# Altium project V67_DASH_VCU.PrjPcb
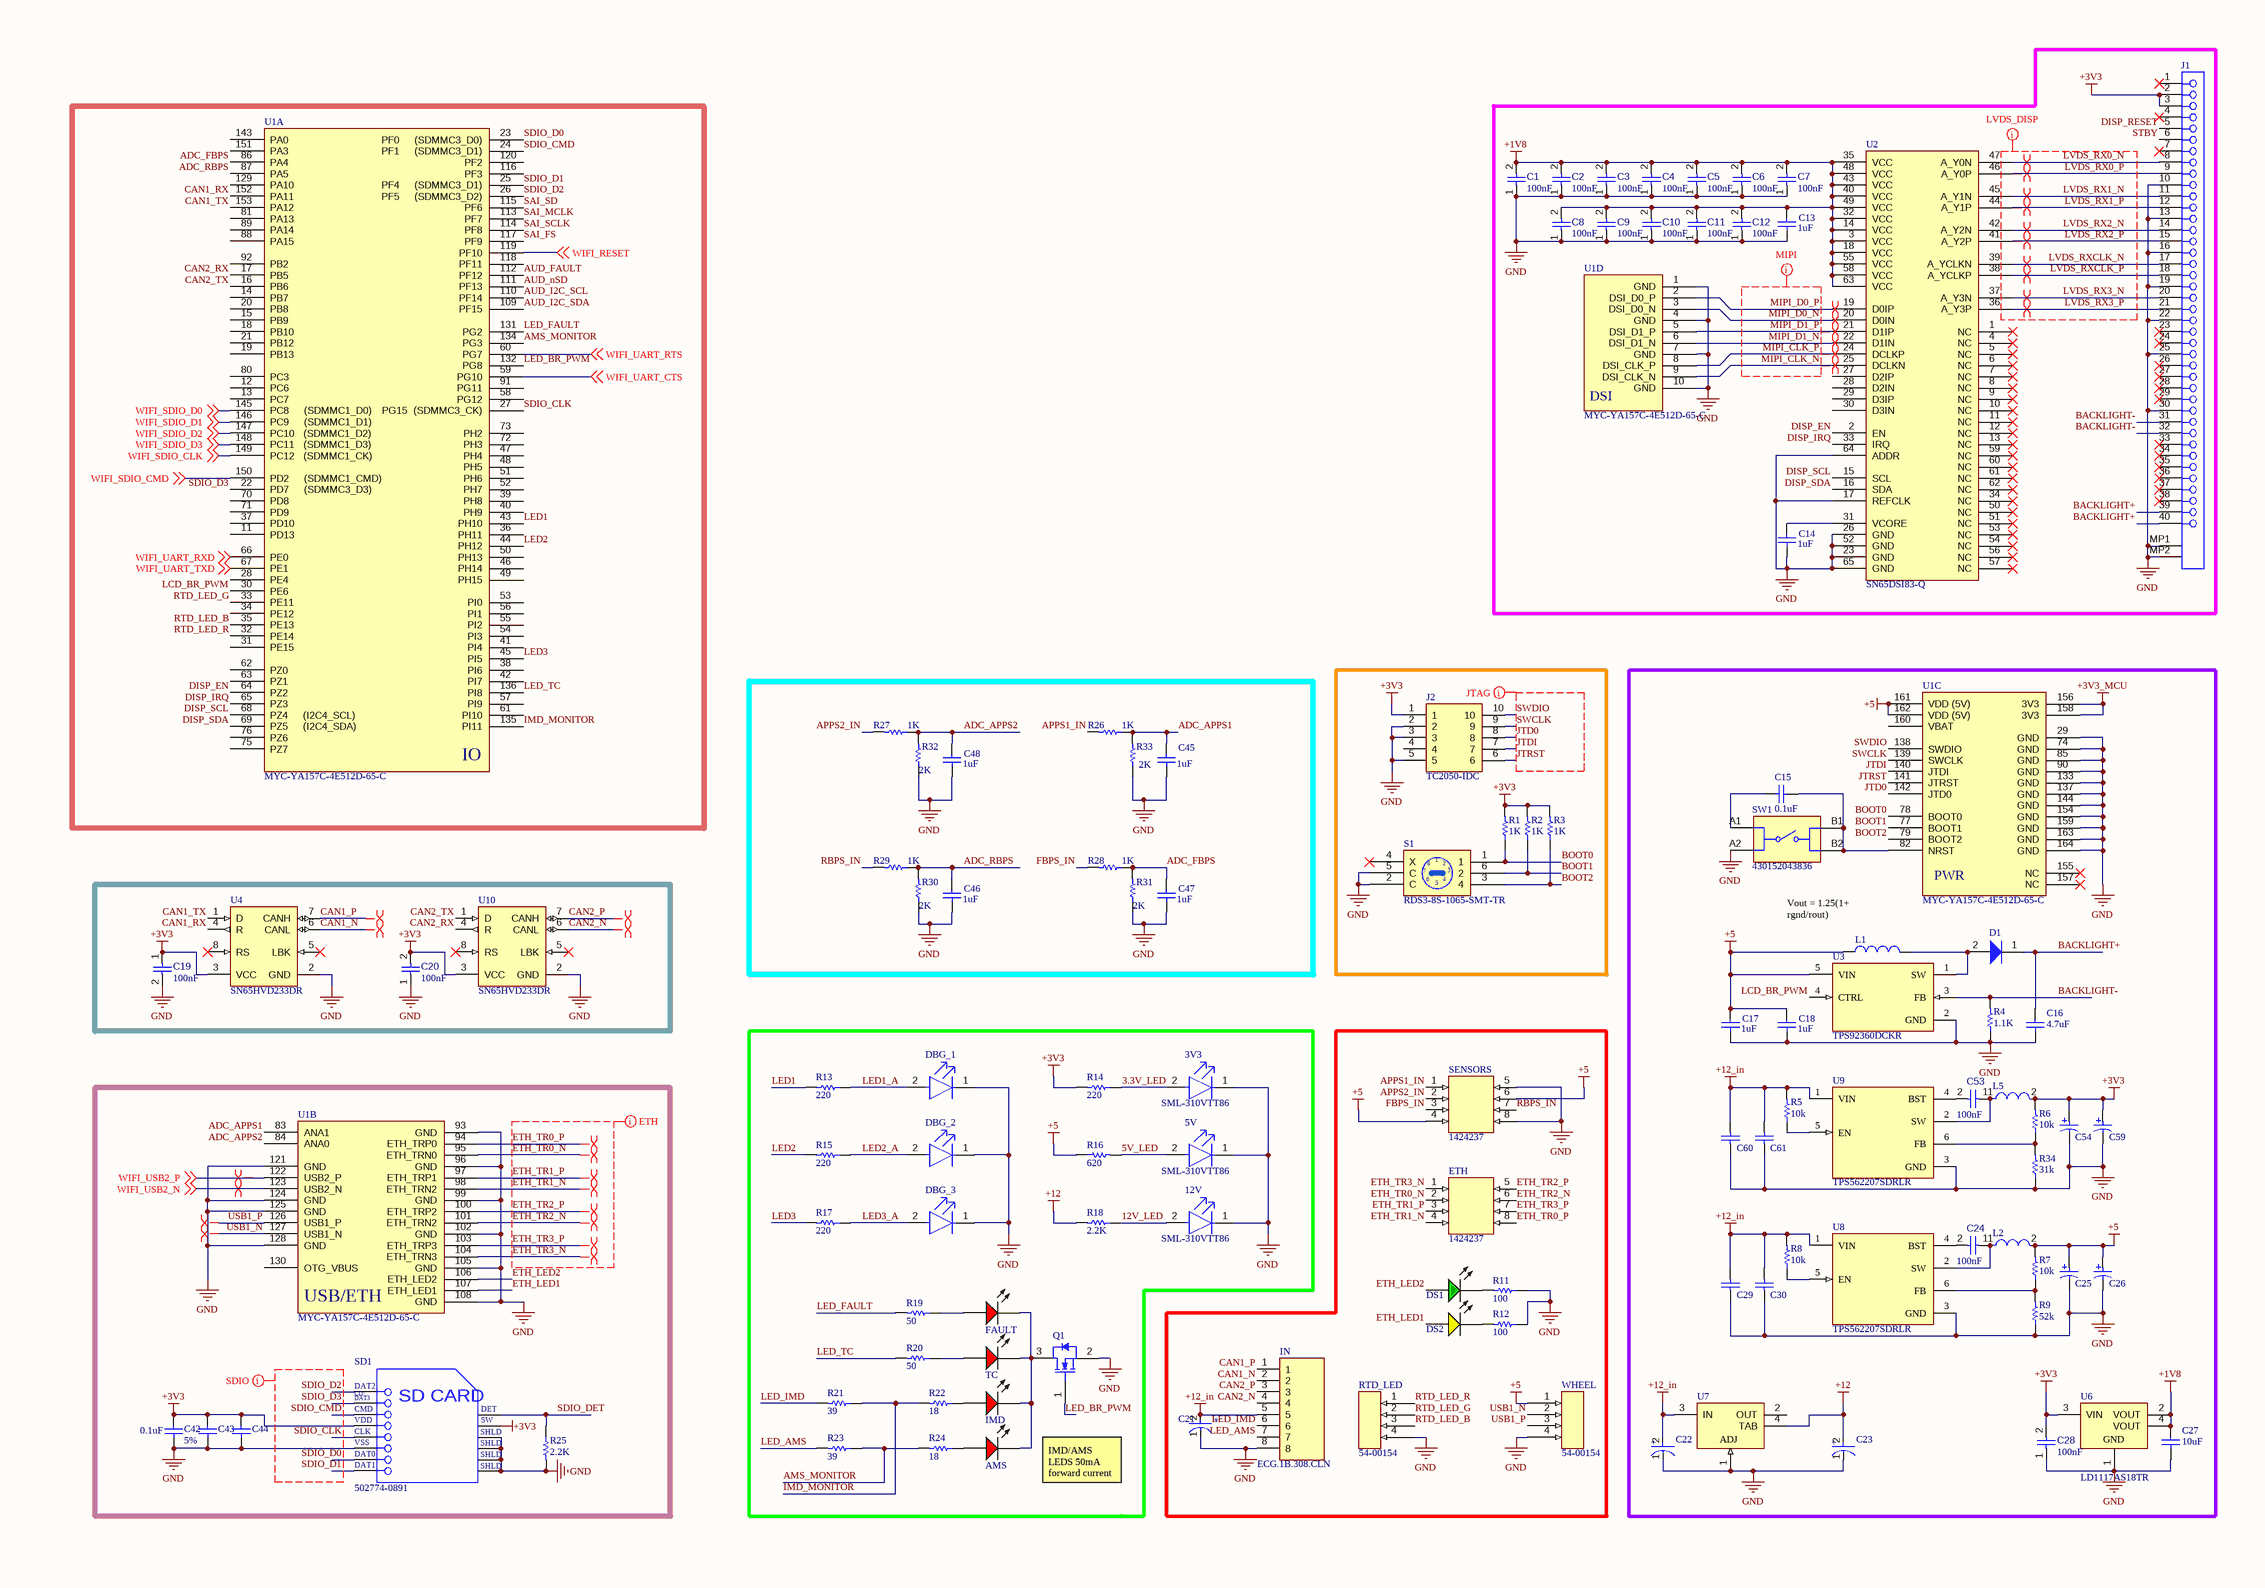
[diagram p0: Main.SchDoc]
CAGE_CODE: ?????; CONTRACT_NUMBER: <CONTRACT NO>; DOC_NO_ASSY_DWG: <ASSY DWG NO>; DOC_NO_BOM: <BOM DOC NO>; DOC_NO_FAB_DWG: <FAB DWG NO>; DOC_NO_SCH_DWG: <SCH DWG NO>; PCB_2_DEC_TOL: +/-.01; PCB_3_DEC_TOL: +/-.010; PCB_ANG_TOL: +/-1/2; PCB_ASSEMBLY_NO: <PCB ASSY NO>; PCB_CHECKER: - -----; PCB_CHECKER_APP_DATE: --/--/----; PCB_DESIGNER: - -----; PCB_DESIGNER_APP_DATE: --/--/----; PCB_DWG_NO: <PCB DWG NO>; PCB_ENGINEER: - -----; PCB_ENGINEER_APP_DATE: --/--/----; PCB_PART_NUMBER: <PCB PN>; PCB_REV: A; SCH_REV: A
3 sheets, 136 parts. Net scope: global (net labels, ports and power ports of the same name join across sheets).
Sheets:
  Main.SchDoc
  wifi.SchDoc
  audio.SchDoc

## Sheet Main.SchDoc
size 508 x 355 mm; SheetNumber: 1; SheetTotal: 3; ENG_APP_DATE: --/--/--; DSN_APP_DATE: --/--/--; CHK_APP_DATE: --/--/--

### Parts
3V3  SML-310VTT86  [FP-SML-310VTT86-MFG]
5V  SML-310VTT86  [FP-SML-310VTT86-MFG]
12V  SML-310VTT86  [FP-SML-310VTT86-MFG]
AMS  C503B-RAN-CY0B0AA2  [CREE-C503B-RAN]  (value not drawn)
C1  value 100nF  [CAPC0402(1005)60_L]  (hidden comment: Capacitor 100nF +/-20% 25V 0402)
C2  value 100nF  [CAPC0402(1005)60_L]  (hidden comment: Capacitor 100nF +/-20% 25V 0402)
C3  value 100nF  [CAPC0402(1005)60_L]  (hidden comment: Capacitor 100nF +/-20% 25V 0402)
C4  value 100nF  [CAPC0402(1005)60_L]  (hidden comment: Capacitor 100nF +/-20% 25V 0402)
C5  value 100nF  [CAPC0402(1005)60_L]  (hidden comment: Capacitor 100nF +/-20% 25V 0402)
C6  value 100nF  [CAPC0402(1005)60_L]  (hidden comment: Capacitor 100nF +/-20% 25V 0402)
C7  value 100nF  [CAPC0402(1005)60_L]  (hidden comment: Capacitor 100nF +/-20% 25V 0402)
C8  value 100nF  [CAPC0402(1005)60_L]  (hidden comment: Capacitor 100nF +/-20% 25V 0402)
C9  value 100nF  [CAPC0402(1005)60_L]  (hidden comment: Capacitor 100nF +/-20% 25V 0402)
C10  value 100nF  [CAPC0402(1005)60_L]  (hidden comment: Capacitor 100nF +/-20% 25V 0402)
C11  value 100nF  [CAPC0402(1005)60_L]  (hidden comment: Capacitor 100nF +/-20% 25V 0402)
C12  value 100nF  [CAPC0402(1005)60_L]  (hidden comment: Capacitor 100nF +/-20% 25V 0402)
C13  value 1uF  [1608[0603]]  (hidden comment: Cap)
C14  value 1uF  [1608[0603]]  (hidden comment: Cap)
C15  value 0.1uF  [1608[0603]]  (hidden comment: Cap)
C16  value 4.7uF  [1608[0603]]  (hidden comment: Cap)
C17  value 1uF  [1608[0603]]  (hidden comment: Cap)
C18  value 1uF  [1608[0603]]  (hidden comment: Cap)
C19  value 100nF  [CAPC0402(1005)60_L]  (hidden comment: Capacitor 100nF +/-20% 25V 0402)
C20  value 100nF  [CAPC0402(1005)60_L]  (hidden comment: Capacitor 100nF +/-20% 25V 0402)
C21  EEFCX0G181XR  [FP-SP-Cap-X-MFG]  (value not drawn)
C22  T491B106K025AT  [FP-T491B106K025AT-MFG]  (value not drawn)
C23  T491B106K025AT  [FP-T491B106K025AT-MFG]  (value not drawn)
C24  value 100nF  [CAPC0402(1005)60_L]  (hidden comment: Capacitor 100nF +/-20% 25V 0402)
C25  T491B226K010AT  [KEMT-T491-B_L]  (value not drawn)
C26  T491B226K010AT  [KEMT-T491-B_L]  (value not drawn)
C27  value 10uF  [1608[0603]]  (hidden comment: Cap)
C28  value 100nF  [CAPC0402(1005)60_L]  (hidden comment: Capacitor 100nF +/-20% 25V 0402)
C29  TACR106K016XTA  [CAPC2014X150X70NL20]  (value not drawn)
C30  TACR106K016XTA  [CAPC2014X150X70NL20]  (value not drawn)
C42  value 0.1uF  Tolerance: 5%  [1608[0603]]  (hidden comment: Cap)
C43  Cap  [1608[0603]]  (value not drawn)
C44  Cap  [1608[0603]]  (value not drawn)
C45  value 1uF  [1608[0603]]  (hidden comment: Cap)
C46  value 1uF  [1608[0603]]  (hidden comment: Cap)
C47  value 1uF  [1608[0603]]  (hidden comment: Cap)
C48  value 1uF  [1608[0603]]  (hidden comment: Cap)
C53  value 100nF  [CAPC0402(1005)60_L]  (hidden comment: Capacitor 100nF +/-20% 25V 0402)
C54  T491B226K010AT  [KEMT-T491-B_L]  (value not drawn)
C59  T491B226K010AT  [KEMT-T491-B_L]  (value not drawn)
C60  TACR106K016XTA  [CAPC2014X150X70NL20]  (value not drawn)
C61  TACR106K016XTA  [CAPC2014X150X70NL20]  (value not drawn)
D1  NSR0240HT1G  [ONSC-SOD-323-2-477-02_V]  (value not drawn)
DBG_1  SML-310VTT86  [FP-SML-310VTT86-MFG]  (value not drawn)
DBG_2  SML-310VTT86  [FP-SML-310VTT86-MFG]  (value not drawn)
DBG_3  SML-310VTT86  [FP-SML-310VTT86-MFG]  (value not drawn)
DS1  HSMG-C190  [AVAG-HSMX-C190_V]  (value not drawn)
DS2  HSMY-C190  [AVAG-HSMX-C190_V]  (value not drawn)
ETH  1424237  [1424237]
FAULT  C503B-RAN-CY0B0AA2  [CREE-C503B-RAN]  (value not drawn)
IMD  C503B-RAN-CY0B0AA2  [CREE-C503B-RAN]  (value not drawn)
IN  ECG.1B.308.CLN  [LEMO_ECG.1B.308.CLN]
J1  54104-4031  [MOLX-54104-4031]  (value not drawn)
J2  TC2050-IDC  [TC2050-IDC]
L1  LPS4018-472MR  [LPS4018-472MR-Footprint-1]  (value not drawn)
L2  IHLP2525AHER4R7M01  [FP-IHLP-2525AH-FP_2_413x3-MFG]  (value not drawn)
L5  IHLP2525AHER4R7M01  [FP-IHLP-2525AH-FP_2_413x3-MFG]  (value not drawn)
Q1  NTR4170NT1G  [ONSC-SOT-23-3-318-08_V]  (value not drawn)
R1  1K  [RESC1609X50X30NL8T20]
R2  1K  [RESC1609X50X30NL8T20]
R3  1K  [RESC1609X50X30NL8T20]
R4  1.1K  [RESC1609X50X30NL8T20]
R5  10k  [RESC1609X50X30NL8T20]
R6  10k  [RESC1609X50X30NL8T20]
R7  10k  [RESC1609X50X30NL8T20]
R8  10k  [RESC1609X50X30NL8T20]
R9  52k  [RESC1609X50X30NL8T20]
R11  100  [RESC1609X50X30NL8T20]
R12  100  [RESC1609X50X30NL8T20]
R13  220  [RESC1609X50X30NL8T20]
R14  220  [RESC1609X50X30NL8T20]
R15  220  [RESC1609X50X30NL8T20]
R16  620  [RESC1609X50X30NL8T20]
R17  220  [RESC1609X50X30NL8T20]
R18  2.2K  [RESC1609X50X30NL8T20]
R19  50  [RESC1609X50X30NL8T20]
R20  50  [RESC1609X50X30NL8T20]
R21  39  [RESC1609X50X30NL8T20]
R22  18  [RESC1609X50X30NL8T20]
R23  39  [RESC1609X50X30NL8T20]
R24  18  [RESC1609X50X30NL8T20]
R25  2.2K  [RESC1609X50X30NL8T20]
R26  1K  [RESC1609X50X30NL8T20]
R27  1K  [RESC1609X50X30NL8T20]
R28  1K  [RESC1609X50X30NL8T20]
R29  1K  [RESC1609X50X30NL8T20]
R30  2K  [RESC1609X50X30NL8T20]
R31  2K  [RESC1609X50X30NL8T20]
R32  2K  [RESC1609X50X30NL8T20]
R33  2K  [RESC1609X50X30NL8T20]
R34  31k  [RESC1609X50X30NL8T20]
RTD_LED  54-00154  [54-00154-Footprint-1]
S1  RDS3-8S-1065-SMT-TR  [RDS3-8S-1065-SMT-TR-Footprint-1]
SD1  502774-0891  [MOLX-502774-0891_V]
SENSORS  1424237  [1424237]
SW1  430152043836  [WS-TASV_L6W6H4.3_4301x20438x6]
TC  C503B-RAN-CY0B0AA2  [CREE-C503B-RAN]  (value not drawn)
U1  MYC-YA157C-4E512D-65-C  [New footprint 1]  (parts A,B,C,D of 4)
U2  SN65DSI83-Q  [TSQFP50P1200X1200X120_HS-65N]
U3  TPS92360DCKR  [FP-DCK0005A-IPC_C]
U4  SN65HVD233DR  [D0008A_M]
U6  LD1117AS18TR  [SOT-223_L]
U7  LM1085IS-ADJ/NOPB  [KTT0003B_M]  (value not drawn)
U8  TPS562207SDRLR  [FP-DRL0006A-MFG]
U9  TPS562207SDRLR  [FP-DRL0006A-MFG]
U10  SN65HVD233DR  [D0008A_M]
WHEEL  54-00154  [54-00154-Footprint-1]

### Nets
+1V8: C1.2 C2.2 C3.2 C4.2 C5.2 C6.2 C7.2 C8.2 C9.2 C10.2 C11.2 C12.2 C13.2 C27.2 U2.3(VCC) U2.14(VCC) U2.18(VCC) U2.32(VCC) U2.35(VCC) U2.40(VCC) U2.43(VCC) U2.48(VCC) U2.49(VCC) U2.55(VCC) U2.58(VCC) U2.63(VCC) U6.2(VOUT) U6.4(VOUT)
+3V3: C19.1 C20.2 C28.2 C42.2 C43.2 C44.2 C54.1 C59.1 J1.2 J1.3 J2.1 L5.2 R1.2 R2.2 R3.2 R6.2 R14.2 SD1.4(VDD) SD1.10(SWITCH) U4.3(VCC) U6.3(VIN) U10.3(VCC)
+3V3_MCU: U1.156(3V3) U1.158(3V3)
+5: C17.2 C18.2 C25.1 C26.1 L1.1 L2.2 R7.2 R16.1 SENSORS.4 SENSORS.6 U1.161(VDD_(5V)) U1.162(VDD_(5V)) U3.5(VIN) WHEEL.1
+12: C23.2(A) R18.2 U7.4(TAB)
+12_in: C21.2(A) C22.2(A) C29.2 C30.2 C60.2 C61.2 IN.5 R5.2 R8.2 U7.3(IN) U8.1(VIN) U9.1(VIN)
GND: 3V3.1(C) 5V.1(C) 12V.1(C) C1.1 C2.1 C3.1 C4.1 C5.1 C6.1 C7.1 C8.1 C9.1 C10.1 C11.1 C12.1 C13.1 C14.1 C16.1 C17.1 C18.1 C19.2 C20.1 C21.1(C) C22.1(C) C23.1(C) C25.2 C26.2 C27.1 C28.1 C29.1 C30.1 C42.1 C43.1 C44.1 C45.1 C46.1 C47.1 C48.1 C54.2 C59.2 C60.1 C61.1 DBG_1.1(C) DBG_2.1(C) DBG_3.1(C) IN.8 J1.10 J1.13 J1.16 J1.19 J1.22 J1.25 J1.30 J1.MP1 J1.MP2 J2.2 J2.3 J2.5 Q1.2(S) R4.1 R9.1 R11.1 R12.1 R25.2 R30.1 R31.1 R32.1 R33.1 R34.1 RTD_LED.4 S1.2(C) S1.5(C) SD1.6(VSS) SD1.11(SHLD) SD1.12(SHLD) SD1.13(SHLD) SD1.14(SHLD) SENSORS.5 SENSORS.8 SW1.A2 U1.1(GND) U1.4(GND) U1.7(GND) U1.10(GND) U1.29(GND) U1.74(GND) U1.85(GND) U1.90(GND) U1.93(GND) U1.96(GND) U1.99(GND) U1.102(GND) U1.105(GND) U1.108(GND) U1.121(GND) U1.124(GND) U1.125(GND) U1.128(GND) U1.133(GND) U1.137(GND) U1.144(GND) U1.154(GND) U1.159(GND) U1.163(GND) U1.164(GND) U2.17(REFCLK) U2.23(GND) U2.26(GND) U2.52(GND) U2.64(ADDR) U2.65(GND) U3.2(GND) U4.2(GND) U6.1(GND) U7.1(ADJ) U8.3(GND) U9.3(GND) U10.2(GND) WHEEL.4
3.3V_LED: 3V3.2(A) R14.1
5V_LED: 5V.2(A) R16.2
12V_LED: 12V.2(A) R18.1
ADC_APPS1: C45.2 R26.1 R33.2 U1.83(ANA1)
ADC_APPS2: C48.2 R27.1 R32.2 U1.84(ANA0)
ADC_FBPS: C47.2 R28.1 R31.2 U1.86(PA4)
ADC_RBPS: C46.2 R29.1 R30.2 U1.87(PA5)
AMS_MONITOR: R23.1 R24.2 U1.134(PG3)
APPS1_IN: R26.2 SENSORS.1
APPS2_IN: R27.2 SENSORS.2
AUD_FAULT: U1.112(PF12)
AUD_I2C_SCL: U1.110(PF14)
AUD_I2C_SDA: U1.109(PF15)
AUD_nSD: U1.111(PF13)
BACKLIGHT+: C16.2 D1.1(K) J1.39 J1.40
BACKLIGHT-: J1.31 J1.32 R4.2 U3.3(FB)
BOOT0: R1.1 S1.1 U1.78(BOOT0)
BOOT1: R2.1 S1.6(2) U1.77(BOOT1)
BOOT2: R3.1 S1.3(4) U1.79(BOOT2)
CAN1_N: IN.2 U4.6(CANL)
CAN1_P: IN.1 U4.7(CANH)
CAN1_RX: U1.152(PA11) U4.4(R)
CAN1_TX: U1.153(PA12) U4.1(D)
CAN2_N: IN.4 U10.6(CANL)
CAN2_P: IN.3 U10.7(CANH)
CAN2_RX: U1.17(PB5) U10.4(R)
CAN2_TX: U1.16(PB6) U10.1(D)
DISP_EN: U1.64(PZ2) U2.2(EN)
DISP_IRQ: U1.65(PZ3) U2.33(IRQ)
DISP_RESET: J1.5
DISP_SCL: U1.68(PZ4_____(I2C4_SCL)) U2.15(SCL)
DISP_SDA: U1.69(PZ5_____(I2C4_SDA)) U2.16(SDA)
ETH_LED1: DS2.1(A) U1.107(ETH_LED1)
ETH_LED2: DS1.1(A) U1.106(ETH_LED2)
ETH_TR0_N: ETH.2 U1.95(ETH_TRN0)
ETH_TR0_P: ETH.8 U1.94(ETH_TRP0)
ETH_TR1_N: ETH.4 U1.98(ETH_TRN2)
ETH_TR1_P: ETH.3 U1.97(ETH_TRP1)
ETH_TR2_N: ETH.6 U1.101(ETH_TRN2)
ETH_TR2_P: ETH.5 U1.100(ETH_TRP2)
ETH_TR3_N: ETH.1 U1.104(ETH_TRN3)
ETH_TR3_P: ETH.7 U1.103(ETH_TRP3)
FBPS_IN: R28.2 SENSORS.3
IMD_MONITOR: R21.1 R22.2 U1.135(PI11)
JTD0: J2.8 U1.142(JTD0)
JTDI: J2.7 U1.140(JTDI)
JTRST: J2.6 U1.141(JTRST)
LCD_BR_PWM: U1.30(PE6) U3.4(CTRL)
LED1: R13.2 U1.43(PH10)
LED1_A: DBG_1.2(A) R13.1
LED2: R15.2 U1.44(PH12)
LED2_A: DBG_2.2(A) R15.1
LED3: R17.2 U1.45(PI5)
LED3_A: DBG_3.2(A) R17.1
LED_AMS: IN.7 R23.2
LED_BR_PWM: Q1.1(G) U1.132(PG8)
LED_FAULT: R19.2 U1.131(PG2)
LED_IMD: IN.6 R21.2
LED_TC: R20.2 U1.136(PI8)
LVDS_RX0_N: J1.8 U2.47(A_Y0N)
LVDS_RX0_P: J1.9 U2.46(A_Y0P)
LVDS_RX1_N: J1.11 U2.45(A_Y1N)
LVDS_RX1_P: J1.12 U2.44(A_Y1P)
LVDS_RX2_N: J1.14 U2.42(A_Y2N)
LVDS_RX2_P: J1.15 U2.41(A_Y2P)
LVDS_RX3_N: J1.20 U2.37(A_Y3N)
LVDS_RX3_P: J1.21 U2.36(A_Y3P)
LVDS_RXCLK_N: J1.17 U2.39(A_YCLKN)
LVDS_RXCLK_P: J1.18 U2.38(A_YCLKP)
MIPI_CLK_N: U1.9(DSI_CLK_N) U2.25(DCLKN)
MIPI_CLK_P: U1.8(DSI_CLK_P) U2.24(DCLKP)
MIPI_D0_N: U1.3(DSI_D0_N) U2.20(D0IN)
MIPI_D0_P: U1.2(DSI_D0_P) U2.19(D0IP)
MIPI_D1_N: U1.6(DSI_D1_N) U2.22(D1IN)
MIPI_D1_P: U1.5(DSI_D1_P) U2.21(D1IP)
RBPS_IN: R29.2 SENSORS.7
RTD_LED_B: RTD_LED.3 U1.35(PE13)
RTD_LED_G: RTD_LED.2 U1.33(PE11)
RTD_LED_R: RTD_LED.1 U1.32(PE14)
SAI_FS: U1.117(PF9)
SAI_MCLK: U1.113(PF7)
SAI_SCLK: U1.114(PF8)
SAI_SD: U1.115(PF6)
SDIO_CLK: SD1.5(CLK) U1.27(PG15__(SDMMC3_CK))
SDIO_CMD: SD1.3(CMD) U1.24(PF1_____(SDMMC3_D1))
SDIO_D0: SD1.7(DAT0) U1.23(PF0_____(SDMMC3_D0))
SDIO_D1: SD1.8(DAT1) U1.25(PF4_____(SDMMC3_D1))
SDIO_D2: SD1.1(DAT2) U1.26(PF5_____(SDMMC3_D2))
SDIO_D3: SD1.2(CD/DAT3) U1.22(PD7_____(SDMMC3_D3))
SDIO_DET: R25.1 SD1.9(DETECT)
STBY: J1.6
SWCLK: J2.9 U1.139(SWCLK)
SWDIO: J2.10 U1.138(SWDIO)
USB1_N: U1.127(USB1_N) WHEEL.2
USB1_P: U1.126(USB1_P) WHEEL.3
WIFI_RESET: U1.119(PF10) ; off-sheet WIFI_RESET
WIFI_SDIO_CLK: U1.149(PC12___(SDMMC1_CK)) ; off-sheet WIFI_SDIO_CLK
WIFI_SDIO_CMD: U1.150(PD2_____(SDMMC1_CMD)) ; off-sheet WIFI_SDIO_CMD
WIFI_SDIO_D0: U1.145(PC8_____(SDMMC1_D0)) ; off-sheet WIFI_SDIO_D0
WIFI_SDIO_D1: U1.146(PC9_____(SDMMC1_D1)) ; off-sheet WIFI_SDIO_D1
WIFI_SDIO_D2: U1.147(PC10___(SDMMC1_D2)) ; off-sheet WIFI_SDIO_D2
WIFI_SDIO_D3: U1.148(PC11___(SDMMC1_D3)) ; off-sheet WIFI_SDIO_D3
WIFI_UART_CTS: U1.59(PG10) ; off-sheet WIFI_UART_CTS
WIFI_UART_RTS: U1.60(PG7) ; off-sheet WIFI_UART_RTS
WIFI_UART_RXD: U1.66(PE0) ; off-sheet WIFI_UART_RXD
WIFI_UART_TXD: U1.67(PE1) ; off-sheet WIFI_UART_TXD
WIFI_USB2_N: U1.123(USB2_N) ; off-sheet WIFI_USB2_N
WIFI_USB2_P: U1.122(USB2_P) ; off-sheet WIFI_USB2_P
NetAMS_1: AMS.1(A) R24.1
NetAMS_2: AMS.2(K) FAULT.2(K) IMD.2(K) Q1.3(D) TC.2(K)
NetC14_2: C14.2 U2.31(VCORE)
NetC15_1: C15.1 SW1.A1
NetC15_2: C15.2 SW1.B1 SW1.B2 U1.82(NRST)
NetC24_1: C24.1 L2.1 U8.2(SW)
NetC24_2: C24.2 U8.4(BST)
NetC53_1: C53.1 L5.1 U9.2(SW)
NetC53_2: C53.2 U9.4(BST)
NetD1_2: D1.2(A) L1.2 U3.1(SW)
NetDS1_2: DS1.2(K) R11.2
NetDS2_2: DS2.2(K) R12.2
NetFAULT_1: FAULT.1(A) R19.1
NetIMD_1: IMD.1(A) R22.1
NetR5_1: R5.1 U9.5(EN)
NetR6_1: R6.1 R34.2 U9.6(FB)
NetR7_1: R7.1 R9.2 U8.6(FB)
NetR8_1: R8.1 U8.5(EN)
NetR20_1: R20.1 TC.1(A)

Not connected (* = marked no-connect by the designer): J1 1* 4* 7* 23* 24* 26* 27* 28* 29* 33* 34* 35* 36* 37* 38*; J2 4; S1 4(X)*; U1 11(PD13) 12(PC6) 13(PC7) 14(PB7) 15(PB9) 18(PB10) 19(PB13) 20(PB8) 21(PB12) 28(PE4) 31(PE15) 34(PE12) 36(PH11) 37(PD10) 38(PI6) 39(PH8) 40(PH9) 41(PI4) 42(PI7) 46(PH14) 47(PH4) 48(PH5) 49(PH15) 50(PH13) 51(PH6) 52(PH7) 53(PI0) 54(PI3) 55(PI2) 56(PI1) 57(PI9) 58(PG12) 61(PI10) 62(PZ0) 63(PZ1) 70(PD8) 71(PD9) 72(PH3) 73(PH2) 75(PZ7) 76(PZ6) 80(PC3) 81(PA13) 88(PA15) 89(PA14) 91(PG11) 92(PB2) 116(PF3) 118(PF11) 120(PF2) 129(PA10) 130(OTG_VBUS) 143(PA0) 151(PA3) 155(NC)* 157(NC)* 160(VBAT); U2 1(NC)* 4(NC)* 5(NC)* 6(NC)* 7(NC)* 8(NC)* 9(NC)* 10(NC)* 11(NC)* 12(NC)* 13(NC)* 27(D2IP) 28(D2IN) 29(D3IP) 30(D3IN) 34(NC)* 50(NC)* 51(NC)* 53(NC)* 54(NC)* 56(NC)* 57(NC)* 59(NC)* 60(NC)* 61(NC)* 62(NC)*; U4 5(LBK)* 8(RS)*; U7 2(OUT); U10 5(LBK)* 8(RS)*

### Layout directives
differential pair: CAN1_N, CAN1_P, CAN2_N, CAN2_P, ETH_TR0_N, ETH_TR0_P, ETH_TR1_N, ETH_TR1_P, ETH_TR2_N, ETH_TR2_P, ETH_TR3_N, ETH_TR3_P, LVDS_RX0_N, LVDS_RX0_P, LVDS_RX1_N, LVDS_RX1_P, LVDS_RX2_N, LVDS_RX2_P, LVDS_RX3_N, LVDS_RX3_P, LVDS_RXCLK_N, LVDS_RXCLK_P, MIPI_CLK_N, MIPI_CLK_P, MIPI_D0_N, MIPI_D0_P, MIPI_D1_N, MIPI_D1_P, USB1_N, USB1_P, WIFI_USB2_N, WIFI_USB2_P
net class MIPI: MIPI_CLK_N, MIPI_CLK_P, MIPI_D0_N, MIPI_D0_P, MIPI_D1_N, MIPI_D1_P
net class LVDS_DISP: LVDS_RX0_N, LVDS_RX0_P, LVDS_RX1_N, LVDS_RX1_P, LVDS_RX2_N, LVDS_RX2_P, LVDS_RX3_N, LVDS_RX3_P, LVDS_RXCLK_N, LVDS_RXCLK_P
net class SDIO: SDIO_CLK, SDIO_CMD, SDIO_D0, SDIO_D1, SDIO_D2, SDIO_D3
net class JTAG: JTD0, JTDI, JTRST, SWCLK, SWDIO
net class ETH: ETH_TR0_N, ETH_TR0_P, ETH_TR1_N, ETH_TR1_P, ETH_TR2_N, ETH_TR2_P, ETH_TR3_N, ETH_TR3_P

### Notes on the sheet
- (near L1) Vout = 1.25(1+ rgnd/rout)
- IMD/AMS LEDS 50mA forward current
- THIS DOCUMENT AND THE DATA DISCLOSED HEREIN OR
- HEREWITH IS THE PROPERTY OF ALTIUM LIMITED AND MAY
- DWG NO:
- REVISION
- REV:
- DESCRIPTION
- DATE
- APPROVED
- BE FREELY DISTRIBUTED IN WHOLE. NO RIGHTS ARE
- RESERVED OR EXPRESS OR IMPLIED WARANTEE GIVEN.
- ENG:
- APPROVALS
- PROJECT
- DSN:
- CHK:
- REFERENCE DOCUMENTS
- PROJECT REVISION:
- TITLE
- DOCUMENT REVISION:
- DESIGN ITEM:
- BOM:
- FAB DWG:
- PCB DWG:
- ASSY DWG:
- SCALE:
- A3
- SIZE
- CAGE CODE
- FILE NAME
- DWG NO.
- SHEET
- OF
- REV
- (in symbol CMP-020-00024-6, part A) IO
- (in symbol CMP-020-00024-6, part B) USB/ETH
- (in symbol CMP-020-00024-6, part C) PWR
- (in symbol CMP-020-00024-6, part D) DSI
- (in symbol CMP-00028-00007-4) 8; 7
- (in symbol CMP-2000-05248-1) CD/; DAT3; SD CARD; DET; SW
- (in symbol CMP-03017-000036-1) +
- (in symbol CMP-05428-000663-1) +

### Library data of the parts
3V3 5V 12V DBG_1-DBG_3 = CMP-08952-000006-1: LED RED CLEAR 0603 SMD; Manufacturer: Rohm; Obsolete Part: true; Wavelength: 630nm; Forward Current: 20mA; Power Dissipation: 55mW; Luminous Intensity: 4mcd; Led Orientation: Top View; Reverse Voltage: 4V; Forward Voltage: 2V; Octopart: https://octopart.com/sml-310vtt86-rohm-550741; Package: 0; Digikey Description: LED RED CLEAR 0603 SMD; Temperature Range Low: -30°C; Mouser Description: Standard LEDs - SMD RED 650NM SMD TRANSPARENT LENS; Automotive: No; Device Class L2: LEDs; Manufacturer Part Number: SML-310VTT86; Category: Diode; Temperature Range High: +85°C; Lead Free: Yes; ComponentLink2Description: Datasheet; Colour: Red; Device Class L3: unset; RoHS: TRUE; ComponentLink2URL: https://www.mouser.com/datasheet/2/348/sml-31-312817.pdf; Temperature: -30°C to +85°C; Device Class L1: Optoelectronics; Height: 0.9mm
AMS FAULT IMD TC = CMP-2000-06058-1: Cree(R) 5-mm Red Round LED, 2.1 V, -40 to 100 degC, 2-Pin THD, RoHS, Ammo; Forward Current: 50mA; Product Depth (mm): 5.8mm; Power Dissipation: 130mW; Viewing Angle: 15°; Test Current (It): 20mA; Shape Type: Circular; Product Height (mm): 8.8mm; Luminous Intensity: 12000mcd; Main Category: StandardLED; Forward Voltage: 2.6V; Number of  Elements: 1; Dominant Wave Length: 624nm; Reverse Voltage: 5V; Mounting Technology: ThroughHole; Datasheet Version: 12/2014; Manufacturer URL: http://www.cree.com/; Packaging: AmmoPack; Operating Temperature Classification: Industrial; Package Description: 2-Pin Through Hole Device, Dia 5.8 mm, Pitch 2.54 mm; Package Reference: C503B-RAN; Type: Uni-Color; Product Length (mm): 5.8mm; Datasheet URL: http://www.cree.com/sitecore-modules/web/~/media/Files/Cree/LED-Components-and-Modules/HB/Data-Sheets/C503B-RAS-RAN-AAS-AAN-RBS-RBN-ABS-ABN-RCS-RCN-ACS-ACN-1079.pdf; Operating Temp Range: -40Cto100C; Manufacturer: Cree; Mounting: ThroughHole; Emitting Color: Red; Lens Dimensions: 5x5x7.8mm; Package Type: T-13/4; Pin Count: 2
C1-C12 C19 C20 C24 C28 C53 = CMP-001-00065-4: Chip Capacitor, 100nF +/-20%, 25V, 0402, Thickness 0.6 mm; Tolerance: 10%; Max Operating Temperature: 85°C; Min Operating Temperature: -55°C; Pins: 2; Voltage Rating: 25V; Mounting Technology: SMT; Case/Package: 0402
C13-C18 C27 C45-C48 = Capacitor: Supplier Part Number 1: *; Supplier 1: *
C21 = CMP-05428-000663-1: Molded Aluminum Polymer Capacitor 180uF 20% 4V life 2000Hours SMD 2917
C22 C23 = CMP-03017-000036-1: CAP TANT 10UF 10% 25V 1411; Life (Hours): 2000Hour; Leakage Current: 2.5uA; ESR (Equivalent Series Resistance): 3R; Ripple Current: 168mA; Polarity: Polar; Dielectric Material: Tantalum; Dissipation Factor: 8%; Package Quantity: 1; Series: T491; Features: General Purpose; Lead Free: Lead Free; Termination: SMD/SMT; Packaging: Tape and Reel; Max Operating Temperature: 125°C; Number of Pins: 2; Case Code (Imperial): 1411; Height - Seated (Max): 0.083inch; Min Operating Temperature: -55°C; Case/Package: 1411; Voltage: 25V; Tolerance: 10%; REACH SVHC: No SVHC; Case Code (Metric): 3528; Depth: 2.8mm; Mount: Surface Mount; Voltage Rating (DC): 25V; Length: 3.5mm; Voltage Rating: 25V; Capacitance: 10uF; Construction: Flat; RoHS Compliant: Yes; Height: 1.9mm; Width: 0.11inch; Radiation Hardening: No
C25 C26 C54 C59 = CMP-2000-07193-1: Tantalum Capacitor, 22 uF, +/- 10%, 10 V, -55 to 125 degC, 2-Pin SMD, RoHS, Tape and Reel; Manufacturer: Kemet; Lead Spacing (nom): NotRequiredmm; Polarity: Polar; Insulation: NotRequired; Voltage: 10VDC; DCL: 2.2uA; ESR: 2.4ohm; Rad Hardened: No; Capacitance: 22000000pF; Product Length (mm): 3.5mm; Case Style: Molded; Product Depth (mm): 2.8mm; DF: 6%; Product Height (mm): 1.9mm; Seated Plane Height: NotRequiredmm; Failure Rate: NotRequired; Datasheet URL: http://capacitoredge.kemet.com/capedge2/DataSheet/Datasheet-T491B226K010AT.pdf?pn=T491B226K010AT; Mounting Technology: SurfaceMount; Datasheet Version: 10/2016; Construction: SMTChip; Package Reference: T491-B; Product Diameter (mm): NotRequiredmm; Operating Temp Range: -55Cto125C; Manufacturer URL: http://www.kemet.com/; Wire Form: NotRequired; Tolerance (+ or -): 10%; Case Code: B; Packaging: TapeandReel; Length W/Weld: NotRequiredmm; Package Description: 2-Pin Surface Mount Device, Body 3.5 x 2.8 mm; Length W/Weld (max): NotRequiredmm; Seal: NotRequired; Mounting Style: SurfaceMount; Package / Case: 3528-21
C29 C30 C60 C61 = CMP-2007-00023-1: Manufacturer: AVX Interconnect / Elco; Part Number: TACR106K016XTA
C42 = Capacitor_0603: Capacitor; Supplier Part Number 1: *; Supplier 1: *
C43 C44 = Capacitor_0603: Capacitor; Tolerance: 5%; Value: 0.1uF; Supplier Part Number 1: *; Supplier 1: *
D1 = CMP-1055-00468-1: Schottky Barrier Diode, 2-Pin SOD-323, Pb-Free, Tape and Reel; Manufacturer: On Semiconductor; Configuration: Single; IFSM Max (A): 1; Packing: Tape and Reel; PackageReference: SOD-323-2-477-02; ComponentLink3URL: http://www.onsemi.com/pub_link/Collateral/477-02.PDF.1; ComponentLink1Description: Manufacturer URL; ComponentLink2URL: http://www.onsemi.cn/pub_link/Collateral/NSR0240H-D.PDF; PackageVersion: Rev. H, 03/2007; ComponentLink1URL: http://www.onsemi.com/; ComponentLink3Description: Package Specification; RoHS: TRUE; PartNumber: NSR0240HT1G; DatasheetVersion: Rev. 1; ComponentLink2Description: Datasheet; Mounting Technology: Surface Mount; PackageDescription: 2-Pin SOD, Body 1.7 x 1.25 mm
DS1 = CMP-1744-00002-1: Chip LED, Green, 2.2 V, -40 to 85 degC, 2-Pin SMD, RoHS, Tape and Reel; Frequency: 400 KHz; Max Supply Voltage: 5.5 V; Access Time: 3500 ns; Clock Frequency: 100 KHz; Case\Package: SOIC; Density: 32 kb; Nominal Supply Current: 2 mA; Interface: Serial; Min Supply Voltage: 1.7 V; Packaging: Tape and Reel; PackageReference: HSMX-C190; ComponentLink2URL: http://docs.avagotech.com/docs/AV02-0551EN; RoHSCompliant: true; Pins: 8; REACH SVHC: No SVHC; Max Operating Temperature: 85 degC; Width: 4 mm; Radiation Hardening: No; Package Quantity: 3000; ComponentLink3Description: Package Specification; ComponentLink1Description: Manufacturer URL; Min Operating Temperature: -40 degC; PackageDescription: 2-Pin Surface Mount Device, Body 1.6 x 0.8 mm, Height 0.9 mm; Max Clock Frequency: 100 KHz; Height: 1.5 mm; ComponentLink1URL: http://www.avagotech.com/; DatasheetVersion: Mar-12; ComponentLink2Description: Datasheet; Mount: Surface Mount; Length: 5 mm; ComponentLink3URL: http://www.fairchildsemi.com/dwg/MA/MA03D.pdf
DS2 = CMP-1744-00003-1: LED Uni-Color Yellow, 65 mW, 20 mA, -40 to 85 degC, 2-Pin SMD, RoHS, Tape and Reel; Tolerance: 1%; Voltage Rating: 50 V; Power Rating: 100 mW; Case\Package: 0603; Resistance: 390 Ohm; Min Operating Temperature: -55 degC; Length: 1.6 mm; ComponentLink3Description: Package Specification; Mount: Surface Mount; PackageReference: HSMX-C190; ComponentLink2Description: Datasheet; DatasheetVersion: Mar-12; Case Code (Metric): 1608; Pins: 2; Package Quantity: 5000; ComponentLink2URL: http://docs.avagotech.com/docs/AV02-0551EN; ComponentLink1Description: Manufacturer URL; RoHSCompliant: true; Packaging: Tape and Reel; PackageDescription: 2-Pin Surface Mount Device, Body 1.6 x 0.8 mm, Height 0.9 mm; REACH SVHC: No SVHC; ComponentLink3URL: http://www.fairchildsemi.com/dwg/MA/MA03D.pdf; Voltage Rating (DC): 50 V; Width: 0.8 mm; ComponentLink1URL: http://www.avagotech.com/; Max Operating Temperature: 155 degC; Case Code (Imperial): 0603; Height: 0.45 mm
ETH SENSORS = CMP-002-00127-2: Circular Connector; Connector Type: Circular; RoHS Compliant: Yes
IN = CMP-002-00125-1: Conn Circular F 8 POS Solder ST Thru-Hole 8 Terminal 1 Port; Component Type: Standard; Case/Package: None; MP: ECG.1B.308.CLN; Pins: 8; Value: *; Price: None; Design Item ID: ECG.1B.308.CLN; Availability: Unavailable; Source: ECG.1B.308.CLN.SchLib
J1 = CMP-1241-00508-1: 0.5 mm Pitch Easy-On(TM) Type FPC Connector, 2.0 mm Mated Height, Right Angle, ZIF, SMT, Top Contact, 40 Circuits, -20 to 85 degC, ELV and RoHS Compliant, Tape and Reel; Manufacturer: Molex; PCB Retention: Yes; Current (Max per Contact): 0.5A; Stackable: No; Durability (mating cycles max): 20; Pitch - Mating Interface: 0.50mm; Circuits (Loaded): 40; Mated Height: 2.00mm; Entry Angle: 90degrees Angle; Material - Metal: Phosphor Bronze; Voltage (Max): 50V; ComponentLink3URL: http://www.molex.com/pdm_docs/sd/541044031_sd.pdf; ComponentLink2URL: http://www.molex.com/webdocs/datasheets/pdf/en-us/0541044031_FFC_FPC_CONNECTORS.pdf; Number of Rows: 1; ComponentLink1Description: Manufacturer URL; ComponentLink2Description: Datasheet; Mounting Technology: Surface Mount; ComponentLink1URL: http://www.molex.com/molex/index.jsp; RoHS: TRUE; PackageReference: 54104-4031; Polarized to PCB: Yes; ComponentLink3Description: Package Specification; PackageVersion: Rev. F, 06/2012; PackageDescription: 40-Lead FPC Connector, Pitch 0.5 mm; Contact Position: Top; PCB Locator: No; PartNumber: 54104-4031; Orientation: Right Angle; Packing: Tape and Reel
J2 = TC2050-IDC: Connector; Manufacturer_Name: Tag Connect; Datasheet Link: https://datasheet.datasheetarchive.com/originals/distributors/Datasheets_SAMA/51f607a36a24a0aceedaa5d6ebc30014.pdf; Manufacturer_Part_Number: TC2050-IDC
L1 = CMP-006-00021-2: This is a new halogen free version recommended for new designs. Only the termination material, part number, and orientation in the packing tape have changed. The previous version is available only to current customers.
L2 L5 = CMP-02424-000390-1: Commercial Inductors, High Saturation Series 4.7uH 3A 78mΩ 20%; Test Frequency: 100kHz; DC Resistance (DCR): 78mR; Saturation Current: 8A; Core Material: Metal; Shielding: Shielded; Self Resonant Frequency: 5MHz; Packaging: Tape and Reel; Height: 1.8mm; Case/Package: 2525; Mount: Surface Mount; Min Operating Temperature: -55°C; Package Quantity: 2000; RMS Current (Irms): 3A; Inductance: 4.7uH; Radiation Hardening: No; Termination: SMD/SMT; Length: 6.86mm; Military Standard: Not; Max DC Current: 8A; Depth: 6.72mm; Height - Seated (Max): 0.071inch; Tolerance: 20%; Lead Free: Lead Free; Inductance Tolerance: 20%; Current Rating: 3A; Width: 6.47mm; Max Operating Temperature: 125°C
Q1 = CMP-1058-00736-1: Power MOSFET, 30 V, 3.1 A, Single N-Channe, 3-Pin SOT-23, Pb-Free, Tape and Reel; Manufacturer: On Semiconductor; VGS Max (V): 12; Qrr Typ (nC): 2.9; Ciss Typ (pF): 432; Coss Typ (pF): 53.6; V(BR)DSS Min (V): 30; VGS(th) Max (V): 1.4; Channel Polarity: N Channel; Crss Typ (pF): 37.1; ComponentLink3URL: http://www.onsemi.cn/pub_link/Collateral/318-08.PDF; ComponentLink3Description: Package Specification; RoHS: Pb-Free; PackageVersion: Rev. AP, 11/2009; DatasheetVersion: Rev. 1; PackageDescription: 3-Pin Small Outline Transistor, Body 2.92 x 1.3 mm, Pitch 0.95 mm; ComponentLink2Description: Datasheet; ComponentLink2URL: http://www.onsemi.cn/pub_link/Collateral/NTR4170N-D.PDF; Package Type: SOT-23-3; PartNumber: NTR4170NT1G; ComponentLink1Description: Manufacturer URL; Mounting Technology: Surface Mount; Packing: Tape and Reel; Configuration: Single; PackageReference: SOT-23-3-318-08; ComponentLink1URL: http://www.onsemi.com/
R1-R3 R26-R29 = CMP-1666-00005-4: Chip Resistor, 10 KOhm, +/- 1%, 100 mW, -55 to 155 degC, 0603 (1608 Metric), RoHS, Tape and Reel; Manufacturer: Vishay Semiconductor; Voltage Rating: 75 V; Max Operating Temperature: 155 degC; PackageDescription: 2-Pin Surface Mount Device, Body 1.575 x 0.85 mm; ComponentLink1Description: Manufacturer URL; RoHSCompliant: true; PackageReference: 0603; REACH SVHC: Unknown; Length: 1.55 mm; DatasheetVersion: 06/2012; Packaging: Tape and Reel; Min Operating Temperature: -55 degC; Mounting Technology: Surface Mount; ComponentLink2URL: https://datasheet.ciiva.com/11809/0900766b80d98afc-11809037.pdf; Height: 0.45 mm; ComponentLink2Description: Datasheet; Package Quantity: 5000; ComponentLink1URL: http://www.vishay.com/; Value: 1K
R4-R9 R11-R25 R30-R34 = CMP-1666-00005-4: Chip Resistor, 10 KOhm, +/- 1%, 100 mW, -55 to 155 degC, 0603 (1608 Metric), RoHS, Tape and Reel; Manufacturer: Vishay Semiconductor; Voltage Rating: 75 V; Value: 1K; Max Operating Temperature: 155 degC; PackageDescription: 2-Pin Surface Mount Device, Body 1.575 x 0.85 mm; ComponentLink1Description: Manufacturer URL; RoHSCompliant: true; PackageReference: 0603; REACH SVHC: Unknown; Length: 1.55 mm; DatasheetVersion: 06/2012; Packaging: Tape and Reel; Min Operating Temperature: -55 degC; Mounting Technology: Surface Mount; ComponentLink2URL: https://datasheet.ciiva.com/11809/0900766b80d98afc-11809037.pdf; Height: 0.45 mm; ComponentLink2Description: Datasheet; Package Quantity: 5000; ComponentLink1URL: http://www.vishay.com/
RTD_LED WHEEL = CMP-002-00074-1: Conn Rcpt Fmale Pnl Mnt 4POS
S1 = CMP-00028-00007-4: switch
SD1 = CMP-2000-05248-1: Micro SD Memory Card Connector, 0.5 A, 10 V (DC), -25 to 85 degC, 8-Pin SMT, RoHS, Tape and Reel; Manufacturer: Molex; 3D Model: 502774-0891.stp; Online Catalog: microSD™Series; Number of Positions: 10(8+2); Card Type: SecureDigital-microSD™; Insertion, Removal Method: PushIn,PushOut; Other Names: WM24066DKR; Connector Type: ConnectorandEjector; Features: Switch; Family: MemoryConnectors-PCCardSockets; Manufacturer URL: http://www.molex.com/; Mounting Type: SurfaceMount,RightAngle; Contact Finish Thickness: 20µin(0.51µm); Standard Package: 1; Series: 502774; Ejector Side: -; Datasheet Version: Rev. D, 04/2004; Category: Connectors,Interconnects; Contact Finish: Gold; Datasheet URL: https://datasheet.ciiva.com/1104/1499551-1104671.pdf; RoHS Information: 502774-0891CertofCompliance; Mounting Feature: Reverse-Bottom; Packaging: Digi-Reel; Height Above Board: 0.071"(1.80mm); Catalog Drawings: 502774-0891
SW1 = CMP-1452-00002-2: NexarPartId: 22861785; Voltage Rating: 12V; Current Rating: 50mA; Switch Travel: 250µm; Switch Function: Off-Mom; Actuator Material: Liquid Crystal Polymer, Polymer; Insulation Resistance: 100MΩ; Actuator Length: 900µm; Throw Configuration: SPST; Mechanical Life: 200kcycles; Illumination Type: Illuminated, Non-Illuminated; Mount: Surface Mount; Max Operating Temperature: 85°C; Height: 4.3mm; RoHS: Compliant; Length: 6.2mm; Color: Orange; Width: 6.2mm; Contact Current Rating: 50mA; Diameter: 3.5mm; Termination: Gull Wing; Packaging: Tape and Reel; REACH SVHC: No SVHC; Contact Plating: Silver; Min Operating Temperature: -40°C; Contact Material: Stainless Steel, Steel
U1 = CMP-020-00024-6: Thing from china
U2 = CMP-015-00009-6: MIPI to LVDS converter
U3 = CMP-04914-000056-1: 38-V 1.2-A single channel LED backlight driver 5-SC70 -40 to 85
U4 U10 = CMP-0315-00038-2: 3.3V CAN Transceiver with Standby Mode, Loop-back, 6 mA, -40 to 125 degC, 8-pin SOIC (D), Green (RoHS & no Sb/Br); Manufacturer: Texas Instruments; Rating: Catalog; ICC(Max)(mA): 6; Receivers Per Package: 1; Supply Voltage(s)(V): 3.3; Transient Pulse Protection(V): -100 to 100; Bus Fault Voltage(V): +/-30; Footprint: PCA82C250, excludes pin5; Code_JEDEC: MS-012AA; PackageVersion: revM, Jun-2011; ComponentLink1Description: Datasheet; Mounting Technology: Surface Mount; SubFamily: CAN; DatasheetVersion: SLLS557F; PartNumber: SN65HVD233DR; PackageReference: D0008A; Drivers Per Package: 1; ComponentLink1URL: http://www.ti.com/general/docs/lit/getliterature.tsp?genericPartNumber=SN65HVD233&fileType=pdf; PackageDescription: 8-Pin Plastic Small Outline Integrated Circuit, 4.9 x 3.9 mm, Pitch 1.27 mm Pitch; Eco-Plan: Green (RoHS & no Sb/Br); Features: Loop Back; Low Power Mode: Standby; Isolated: No
U6 = CMP-0244-00319-1: 1A, Low Drop Positive Voltage Regulator, 1.8V, 4-Pin SOT-223, Tape and Reel; DatasheetVersion: 2/12/2011; ComponentLink2URL: http://www.st.com/internet/com/TECHNICAL_RESOURCES/TECHNICAL_LITERATURE/DATASHEET/CD00002116.pdf; ComponentLink1Description: Manufacturer URL; ComponentLink1URL: http://www.st.com; PackageReference: SOT-223; PackageVersion: 2010; PackageDescription: 4-Pin SOT-223 Package, 6.5 x 3.5 mm Body, 2.3 mm Pitch, 7 mm Lead Span; ComponentLink2Description: Datasheet
U7 = CMP-0062-00603-5: 3A Low Dropout Positive Regulators, 3-pin TO-263, Pb-Free; Manufacturer: Texas Instruments; PowerWise: N; CompType: LDO IC; PackageTopMarking: NSUZXYTTE#*LM1085*IS-ADJ; High-Reliability: Y; RoHS: Y; ComponentLink1Description: Datasheet URL; ComponentLink1URL: http://www.ti.com/general/docs/lit/getliterature.tsp?genericPartNumber=LM1085&fileType=pdf; PackageReference: KTT0003B; PinCount: 3; PartNumber: LM1085IS-ADJ/NOPB; Code_JEDEC: MO-169-AA; PackageDescription: TO-263, Molded, .400 x .390 x .180in, 3 Lead, .1in Pitch, Surface Mount
U8 U9 = CMP-04918-000669-1: 4.3-V TO 17-V INPUT, 2-A FCCM MO; RoHS Compliant: Yes

## Sheet wifi.SchDoc
size A portrait; SheetNumber: 2; SheetTotal: 2
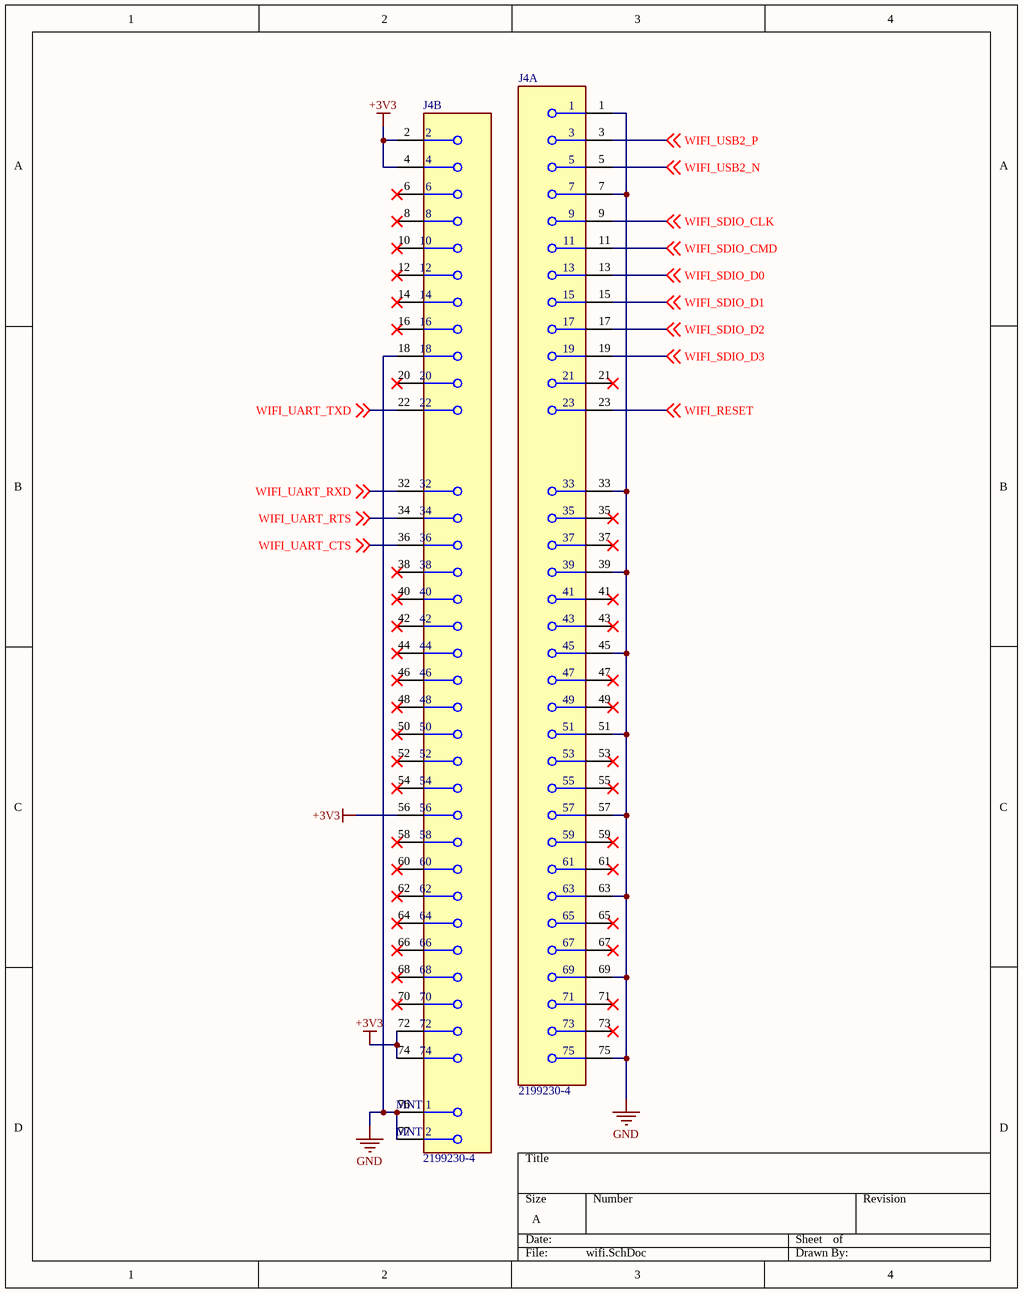
[diagram p1: wifi.SchDoc]

### Parts
J4  2199230-4  [FP-2199230-4-MFG]  (parts A,B of 2)

### Nets
+3V3: J4.2 J4.4 J4.56 J4.72 J4.74
GND: J4.1 J4.7 J4.18 J4.33 J4.39 J4.45 J4.51 J4.57 J4.63 J4.69 J4.75 J4.76(MNT_1) J4.77(MNT_2)
WIFI_RESET: J4.23 ; off-sheet WIFI_RESET
WIFI_SDIO_CLK: J4.9 ; off-sheet WIFI_SDIO_CLK
WIFI_SDIO_CMD: J4.11 ; off-sheet WIFI_SDIO_CMD
WIFI_SDIO_D0: J4.13 ; off-sheet WIFI_SDIO_D0
WIFI_SDIO_D1: J4.15 ; off-sheet WIFI_SDIO_D1
WIFI_SDIO_D2: J4.17 ; off-sheet WIFI_SDIO_D2
WIFI_SDIO_D3: J4.19 ; off-sheet WIFI_SDIO_D3
WIFI_UART_CTS: J4.36 ; off-sheet WIFI_UART_CTS
WIFI_UART_RTS: J4.34 ; off-sheet WIFI_UART_RTS
WIFI_UART_RXD: J4.32 ; off-sheet WIFI_UART_RXD
WIFI_UART_TXD: J4.22 ; off-sheet WIFI_UART_TXD
WIFI_USB2_N: J4.5 ; off-sheet WIFI_USB2_N
WIFI_USB2_P: J4.3 ; off-sheet WIFI_USB2_P

Not connected (* = marked no-connect by the designer): J4 6* 8* 10* 12* 14* 16* 20* 21* 35* 37* 38* 40* 41* 42* 43* 44* 46* 47* 48* 49* 50* 52* 53* 54* 55* 58* 59* 60* 61* 62* 64* 65* 66* 67* 68* 70* 71* 73*

### Library data of the parts
J4 = CMP-03365-000002-1: CONN FEMALE 67POS 0.020 GOLD; Manufacturer: TE Connectivity; Conn Orientation: Right Angle; Pitch: 0.5mm; Number Of Contacts: 67; Voltage Rating: 50V; Is Female: yes; Current Rating: 0.5A; Lead Free: Yes; Temperature Range Low: -40°C; Device Class L3: unset; Package: 0; Manufacturer Part Number: 2199230-4; RoHS: TRUE; Digikey Description: CONN FEMALE 67POS 0.020 GOLD; Category: Conn; Device Class L1: Connectors; Temperature Range High: +80°C; ComponentLink2Description: Datasheet; ComponentLink2URL: https://www.te.com/commerce/DocumentDelivery/DDEController?Action=showdoc&DocId=Customer+Drawing%7F2199230%7FB3%7Fpdf%7FEnglish%7FENG_CD_2199230_B3.pdf%7F2199230-4; Mouser Description: PCI Express / PCI Connectors .5PITCH 4.2H KEY E EMBOSS NGFF MINICARD; Automotive: No; Conn Gender: Female; Height: 4.2mm; Device Class L2: Card Edge Connectors; Contact Material: Gold,Nickel; Number Of Rows: 2; Octopart: https://octopart.com/2199230-4-te+connectivity-46436156; Temperature: -40°C to +80°C

## Sheet audio.SchDoc
size A; SheetNumber: 3; SheetTotal: 3
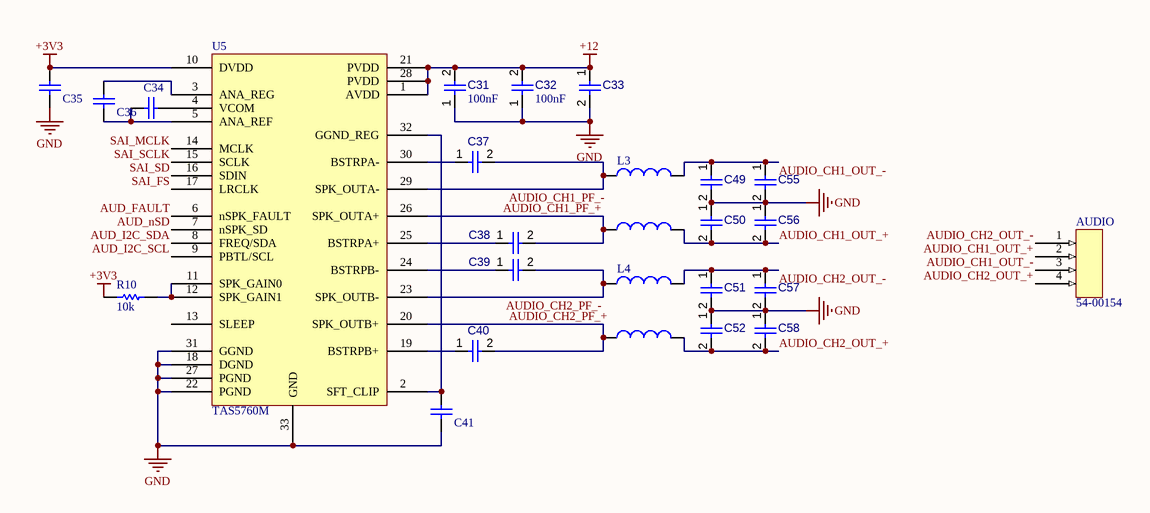
[diagram p2: audio.SchDoc]

### Parts
AUDIO  54-00154  [54-00154-Footprint-1]
C31  value 100nF  [CAPC0402(1005)60_L]  (hidden comment: Capacitor 100nF +/-20% 25V 0402)
C32  value 100nF  [CAPC0402(1005)60_L]  (hidden comment: Capacitor 100nF +/-20% 25V 0402)
C33  T59EE477M016C0025  [CAPC7343X43N]  (value not drawn)
C34  TACL105M016XTA  [CAPC1609X100X15NL20]  (value not drawn)
C35  TACL105M016XTA  [CAPC1609X100X15NL20]  (value not drawn)
C36  TACL105M016XTA  [CAPC1609X100X15NL20]  (value not drawn)
C37  16MU224MZ22012  [CAPC2014X10N]  (value not drawn)
C38  16MU224MZ22012  [CAPC2014X10N]  (value not drawn)
C39  16MU224MZ22012  [CAPC2014X10N]  (value not drawn)
C40  16MU224MZ22012  [CAPC2014X10N]  (value not drawn)
C41  TACL105M016XTA  [CAPC1609X100X15NL20]  (value not drawn)
C49  16MU224MZ22012  [CAPC2014X10N]  (value not drawn)
C50  16MU224MZ22012  [CAPC2014X10N]  (value not drawn)
C51  16MU224MZ22012  [CAPC2014X10N]  (value not drawn)
C52  16MU224MZ22012  [CAPC2014X10N]  (value not drawn)
C55  16MU224MZ22012  [CAPC2014X10N]  (value not drawn)
C56  16MU224MZ22012  [CAPC2014X10N]  (value not drawn)
C57  16MU224MZ22012  [CAPC2014X10N]  (value not drawn)
C58  16MU224MZ22012  [CAPC2014X10N]  (value not drawn)
L3  ACDL2V0910-100-R  [ACDL2V0910-100-R-Footprint-1]  (value not drawn)
L4  ACDL2V0910-100-R  [ACDL2V0910-100-R-Footprint-1]  (value not drawn)
R10  10k  [RESC1609X50X30NL8T20]
U5  TAS5760M  [TSOP65P810X120_HS-33N]

### Nets
+3V3: C35.2 R10.2 U5.10(DVDD)
+12: C31.2 C32.2 C33.1 U5.1(AVDD) U5.21(PVDD) U5.28(PVDD)
GND: C31.1 C32.1 C33.2 C35.1 C41.2 C49.2 C50.1 C51.2 C52.1 C55.2 C56.1 C57.2 C58.1 U5.18(DGND) U5.22(PGND) U5.27(PGND) U5.31(GGND) U5.33(GND)
AUD_FAULT: U5.6(nSPK_FAULT)
AUD_I2C_SCL: U5.9(PBTL/SCL)
AUD_I2C_SDA: U5.8(FREQ/SDA)
AUD_nSD: U5.7(nSPK_SD)
AUDIO_CH1_OUT_+: AUDIO.2 C50.2 C56.2 L3.4
AUDIO_CH1_OUT_-: AUDIO.3 C49.1 C55.1 L3.2
AUDIO_CH1_PF_+: C38.2 L3.3 U5.26(SPK_OUTA+)
AUDIO_CH1_PF_-: C37.2 L3.1 U5.29(SPK_OUTA-)
AUDIO_CH2_OUT_+: AUDIO.4 C52.2 C58.2 L4.4
AUDIO_CH2_OUT_-: AUDIO.1 C51.1 C57.1 L4.2
AUDIO_CH2_PF_+: C40.2 L4.3 U5.20(SPK_OUTB+)
AUDIO_CH2_PF_-: C39.2 L4.1 U5.23(SPK_OUTB-)
SAI_FS: U5.17(LRCLK)
SAI_MCLK: U5.14(MCLK)
SAI_SCLK: U5.15(SCLK)
SAI_SD: U5.16(SDIN)
NetC34_1: C34.1 C36.1 U5.5(ANA_REF)
NetC34_2: C34.2 U5.4(VCOM)
NetC36_2: C36.2 U5.3(ANA_REG)
NetC37_1: C37.1 U5.30(BSTRPA-)
NetC38_1: C38.1 U5.25(BSTRPA+)
NetC39_1: C39.1 U5.24(BSTRPB-)
NetC40_1: C40.1 U5.19(BSTRPB+)
NetC41_1: C41.1 U5.2(SFT_CLIP) U5.32(GGND_REG)
NetR10_1: R10.1 U5.11(SPK_GAIN0) U5.12(SPK_GAIN1)

Not connected (* = marked no-connect by the designer): U5 13(SLEEP)

### Library data of the parts
AUDIO = CMP-002-00074-1: Conn Rcpt Fmale Pnl Mnt 4POS
C31 C32 = CMP-001-00065-4: as C1 on sheet Main; Max Operating Temperature: 85°C; Min Operating Temperature: -55°C; Pins: 2; Voltage Rating: 25V; Mounting Technology: SMT; Case/Package: 0402
C33 = CMP-001-00085-1: Tantalum Capacitor, Polarized, Tantalum (solid Polymer), 16V, 20% +Tol, 20% -Tol, 470uF, Surface Mount, 2917; Pins: 2; RoHS Compliant: Yes; Capacitor Type: Tantalum
C34-C36 C41 = CMP-2006-00188-1: Manufacturer: AVX Interconnect / Elco; Part Number: TACL105M016XTA
C37-C40 C49-C52 C55-C58 = CMP-001-00084-1: Film Capacitor, 16V, 20% +Tol, 20% -Tol, 0.22uF, Surface Mount, 0805; Capacitor Type: Aluminium; RoHS Compliant: Yes; Pins: 2
L3 L4 = CMP-006-00024-1: 2 ch inductor for audio
R10 = CMP-1666-00005-4: as R4 on sheet Main; Max Operating Temperature: 155 degC; PackageDescription: 2-Pin Surface Mount Device, Body 1.575 x 0.85 mm; ComponentLink1Description: Manufacturer URL; RoHSCompliant: true; PackageReference: 0603; REACH SVHC: Unknown; Length: 1.55 mm; DatasheetVersion: 06/2012; Packaging: Tape and Reel; Min Operating Temperature: -55 degC; Mounting Technology: Surface Mount; ComponentLink2URL: https://datasheet.ciiva.com/11809/0900766b80d98afc-11809037.pdf; Height: 0.45 mm; ComponentLink2Description: Datasheet; Package Quantity: 5000; ComponentLink1URL: http://www.vishay.com/
U5 = CMP-014-00002-2

## Nets that join several sheets
+3V3: Main (22 pins), wifi (5 pins), audio (C35.2 R10.2 U5.10)
+12: Main (C23.2 R18.2 U7.4), audio (6 pins)
GND: Main (119 pins), wifi (13 pins), audio (18 pins)
AUD_FAULT: Main (U1.112), audio (U5.6)
AUD_I2C_SCL: Main (U1.110), audio (U5.9)
AUD_I2C_SDA: Main (U1.109), audio (U5.8)
AUD_nSD: Main (U1.111), audio (U5.7)
SAI_FS: Main (U1.117), audio (U5.17)
SAI_MCLK: Main (U1.113), audio (U5.14)
SAI_SCLK: Main (U1.114), audio (U5.15)
SAI_SD: Main (U1.115), audio (U5.16)
WIFI_RESET: Main (U1.119), wifi (J4.23)
WIFI_SDIO_CLK: Main (U1.149), wifi (J4.9)
WIFI_SDIO_CMD: Main (U1.150), wifi (J4.11)
WIFI_SDIO_D0: Main (U1.145), wifi (J4.13)
WIFI_SDIO_D1: Main (U1.146), wifi (J4.15)
WIFI_SDIO_D2: Main (U1.147), wifi (J4.17)
WIFI_SDIO_D3: Main (U1.148), wifi (J4.19)
WIFI_UART_CTS: Main (U1.59), wifi (J4.36)
WIFI_UART_RTS: Main (U1.60), wifi (J4.34)
WIFI_UART_RXD: Main (U1.66), wifi (J4.32)
WIFI_UART_TXD: Main (U1.67), wifi (J4.22)
WIFI_USB2_N: Main (U1.123), wifi (J4.5)
WIFI_USB2_P: Main (U1.122), wifi (J4.3)